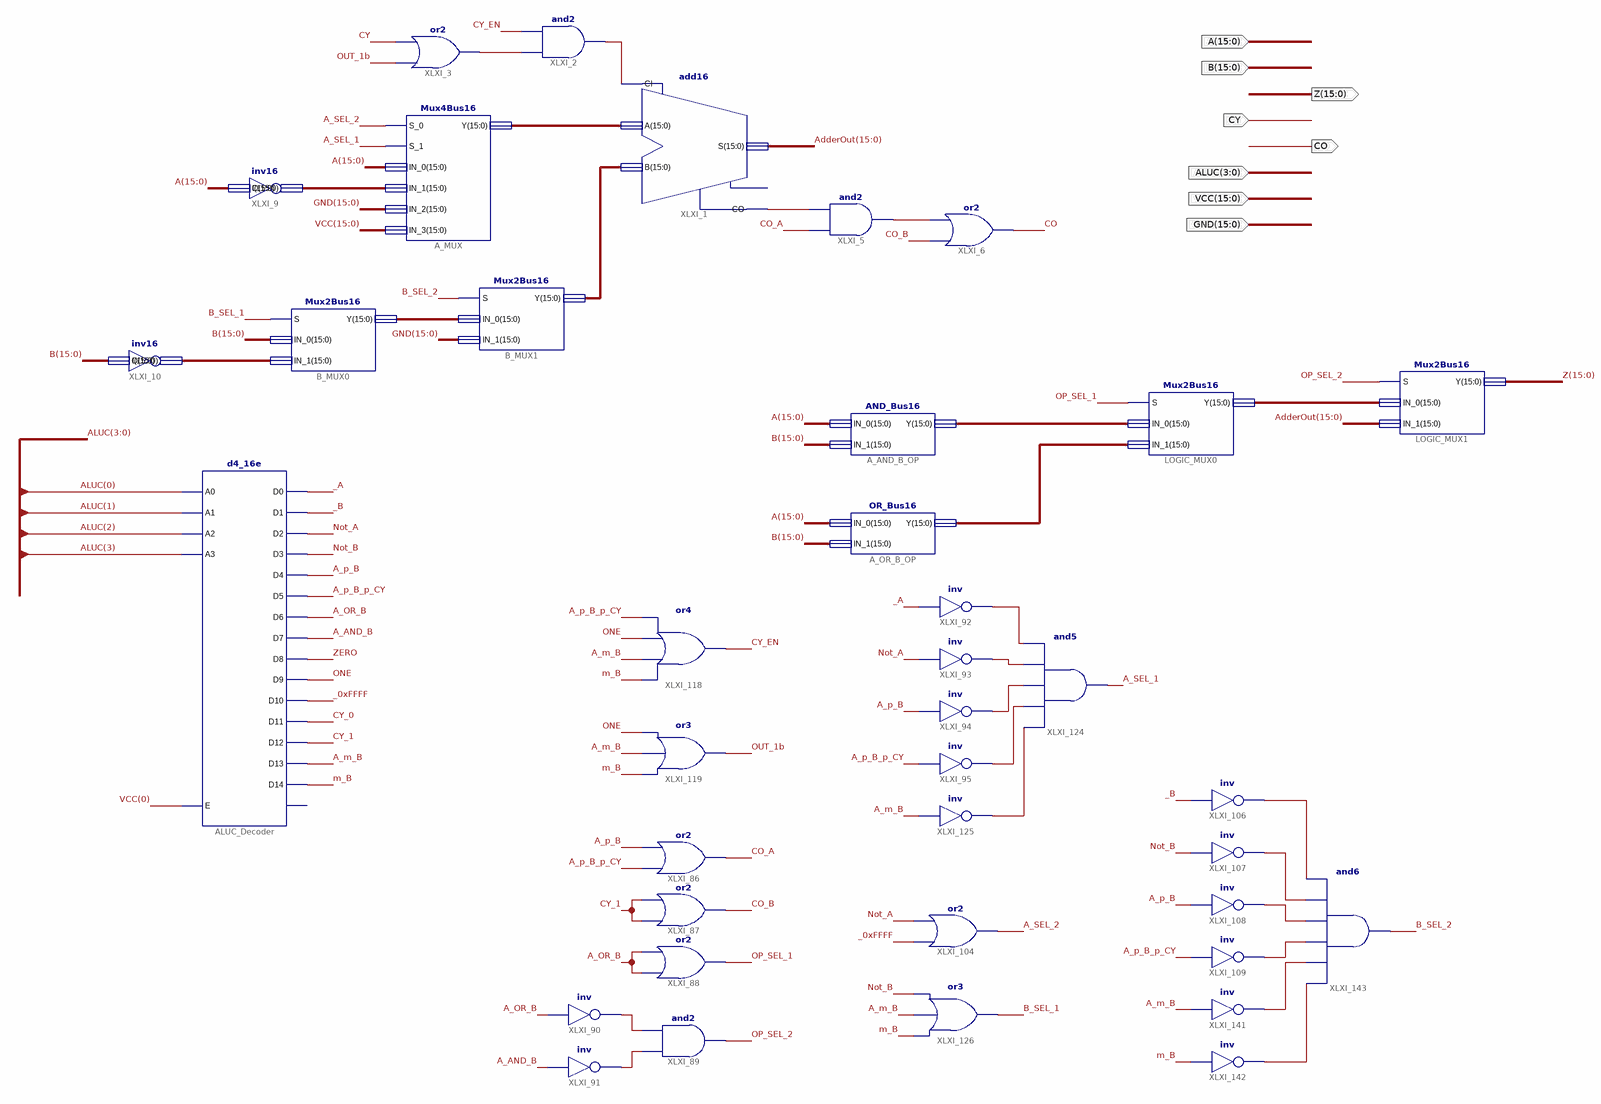
[diagram p0: schematic sheet 1]
// Xilinx ISE schematic ALU_main.sch (artix7) as structural Verilog: 38 symbols, 8 ports
module ALU_main (
  input  [15:0] A,
  input  [15:0] B,
  input  CY,
  input  [3:0] ALUC,
  input  [15:0] VCC,
  input  [15:0] GND,
  output CO,
  output [15:0] Z
);

  wire _0xFFFF, _A, _B, A_AND_B, A_m_B, A_OR_B, A_p_B, A_p_B_p_CY, A_SEL_1, A_SEL_2, B_SEL_1, B_SEL_2, CO_A,
       CO_B, CY_0, CY_1, CY_EN, m_B, Not_A, Not_B, ONE, OP_SEL_1, OP_SEL_2, OUT_1b, XLXN_1, XLXN_2, XLXN_3,
       XLXN_4, XLXN_215, XLXN_216, XLXN_222, XLXN_291, XLXN_292, XLXN_293, XLXN_295, XLXN_343, XLXN_344,
       XLXN_345, XLXN_346, XLXN_347, XLXN_348, ZERO;
  wire [15:0] AdderOut, XLXN_5, XLXN_6, XLXN_7, XLXN_8, XLXN_37, XLXN_38, XLXN_40, XLXN_143;

  d4_16e ALUC_Decoder (
    .A0(ALUC[0]), .A1(ALUC[1]), .A2(ALUC[2]), .A3(ALUC[3]), .E(VCC[0]), .D0(_A), .D1(_B), .D10(_0xFFFF),
    .D11(CY_0), .D12(CY_1), .D13(A_m_B), .D14(m_B), .D2(Not_A), .D3(Not_B), .D4(A_p_B), .D5(A_p_B_p_CY),
    .D6(A_OR_B), .D7(A_AND_B), .D8(ZERO), .D9(ONE));  // open: D15
  add16 XLXI_1 (.A(XLXN_5), .B(XLXN_6), .CI(XLXN_2), .CO(XLXN_3), .S(AdderOut));  // open: OFL
  and XLXI_2 (XLXN_2, XLXN_1, CY_EN);
  or XLXI_3 (XLXN_1, OUT_1b, CY);
  and XLXI_5 (XLXN_4, CO_A, XLXN_3);
  or XLXI_6 (CO, CO_B, XLXN_4);
  Mux4Bus16 A_MUX (.S_0(A_SEL_2), .S_1(A_SEL_1), .IN_0(A), .IN_1(XLXN_8), .IN_2(GND), .IN_3(VCC), .Y(XLXN_5));
  Mux2Bus16 B_MUX1 (.S(B_SEL_2), .IN_0(XLXN_7), .IN_1(GND), .Y(XLXN_6));
  inv16 XLXI_9 (.I(A), .O(XLXN_8));
  Mux2Bus16 B_MUX0 (.S(B_SEL_1), .IN_0(B), .IN_1(XLXN_143), .Y(XLXN_7));
  inv16 XLXI_10 (.I(B), .O(XLXN_143));
  AND_Bus16 A_AND_B_OP (.IN_0(A), .IN_1(B), .Y(XLXN_37));
  OR_Bus16 A_OR_B_OP (.IN_0(A), .IN_1(B), .Y(XLXN_40));
  Mux2Bus16 LOGIC_MUX0 (.S(OP_SEL_1), .IN_0(XLXN_37), .IN_1(XLXN_40), .Y(XLXN_38));
  Mux2Bus16 LOGIC_MUX1 (.S(OP_SEL_2), .IN_0(XLXN_38), .IN_1(AdderOut), .Y(Z));
  or XLXI_86 (CO_A, A_p_B_p_CY, A_p_B);
  or XLXI_87 (CO_B, CY_1, CY_1);
  or XLXI_88 (OP_SEL_1, A_OR_B, A_OR_B);
  and XLXI_89 (OP_SEL_2, XLXN_216, XLXN_215);
  not XLXI_91 (XLXN_216, A_AND_B);
  not XLXI_90 (XLXN_215, A_OR_B);
  or XLXI_118 (CY_EN, m_B, A_m_B, ONE, A_p_B_p_CY);
  or XLXI_119 (OUT_1b, m_B, A_m_B, ONE);
  not XLXI_92 (XLXN_222, _A);
  not XLXI_93 (XLXN_291, Not_A);
  not XLXI_94 (XLXN_292, A_p_B);
  not XLXI_95 (XLXN_293, A_p_B_p_CY);
  not XLXI_125 (XLXN_295, A_m_B);
  and XLXI_124 (A_SEL_1, XLXN_295, XLXN_293, XLXN_292, XLXN_291, XLXN_222);
  or XLXI_104 (A_SEL_2, _0xFFFF, Not_A);
  or XLXI_126 (B_SEL_1, m_B, A_m_B, Not_B);
  not XLXI_106 (XLXN_343, _B);
  not XLXI_107 (XLXN_344, Not_B);
  not XLXI_108 (XLXN_345, A_p_B);
  not XLXI_109 (XLXN_346, A_p_B_p_CY);
  not XLXI_141 (XLXN_347, A_m_B);
  not XLXI_142 (XLXN_348, m_B);
  and XLXI_143 (B_SEL_2, XLXN_348, XLXN_347, XLXN_346, XLXN_345, XLXN_344, XLXN_343);
endmodule
